# Altium schematic sheet MotherBoard_Diagram.SchDoc
size A; SheetNumber: 1; SheetTotal: 9
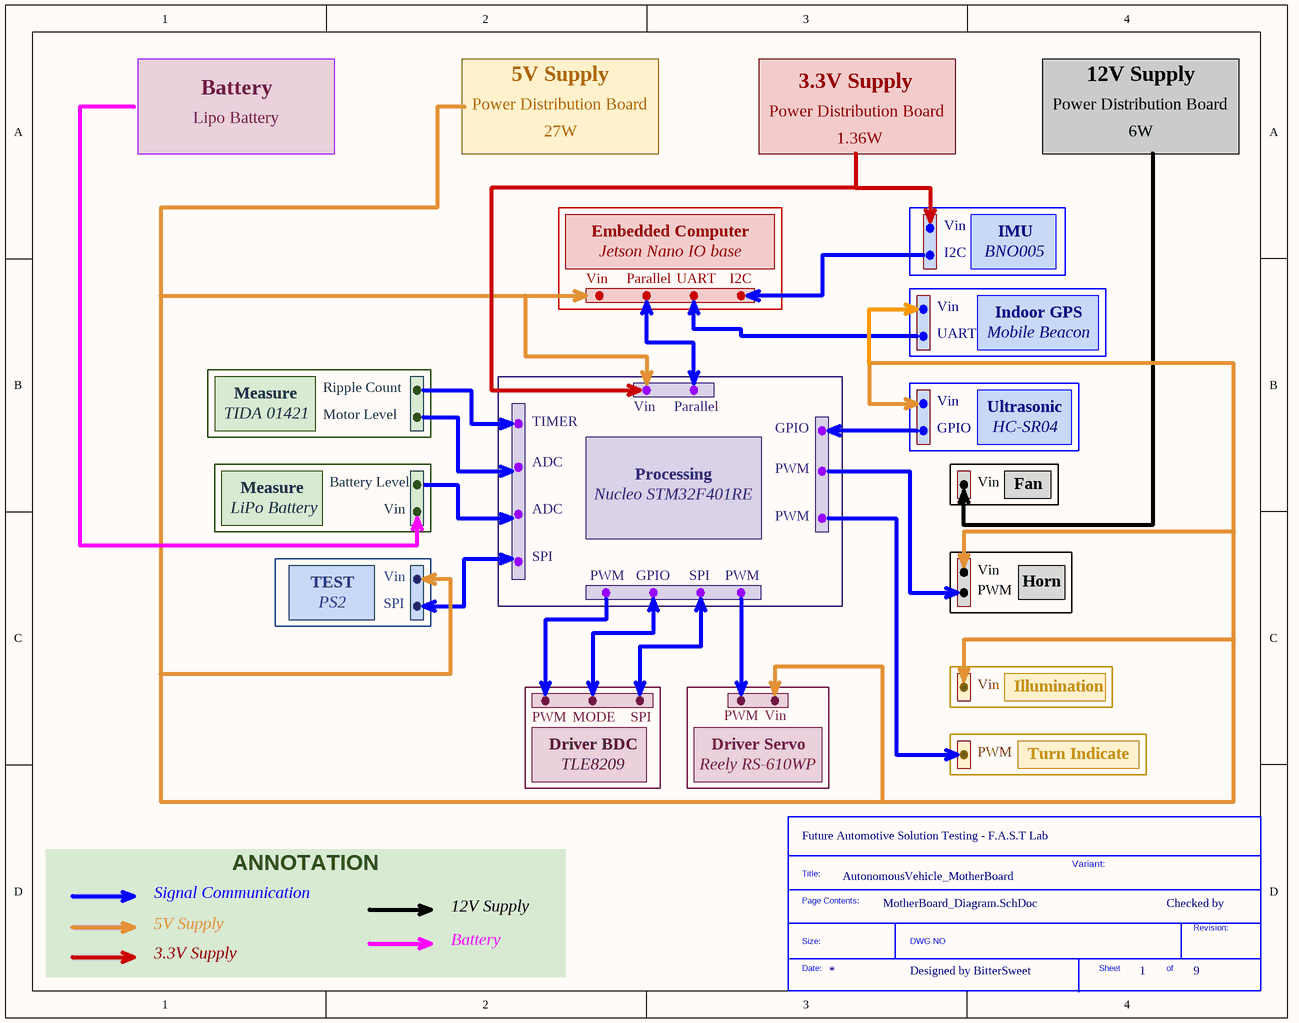
[diagram p0: MotherBoard_Diagram.SchDoc]

## Parts
*?  SDTitleBlock  (value not drawn)  (graphical)

## Notes on the sheet
- Battery
- 5V Supply
- 3.3V Supply
- 12V Supply
- Lipo Battery
- Power Distribution Board
- 27W
- 1.36W
- 6W
- Embedded Computer
- Vin
- IMU
- Jetson Nano IO base
- Parallel
- UART
- I2C
- BNO005
- Mobile Beacon
- Indoor GPS
- TIDA 01421
- Measure
- Ripple Count
- Motor Level
- TIMER
- GPIO
- Ultrasonic
- HC-SR04
- Battery Level
- ADC
- Nucleo STM32F401RE
- Processing
- PWM
- Fan
- LiPo Battery
- SPI
- TEST
- PS2
- Horn
- Illumination
- Driver BDC
- TLE8209
- MODE
- (near *?) Reely RS-610WP
- Driver Servo
- Turn Indicate
- (near *?) Future Automotive Solution Testing - F.A.S.T Lab
- Signal Communication
- AutonomousVehicle_MotherBoard
- Variant:
- Checked by
- ANNOTATION
- Designed by BitterSweet
- (in symbol SDTitleBlock) Title:; Page Contents:; Revision:; Size:; DWG NO; Date:; Sheet; of